# EAGLE design pi-crust15 (EAGLE 6.5.0)
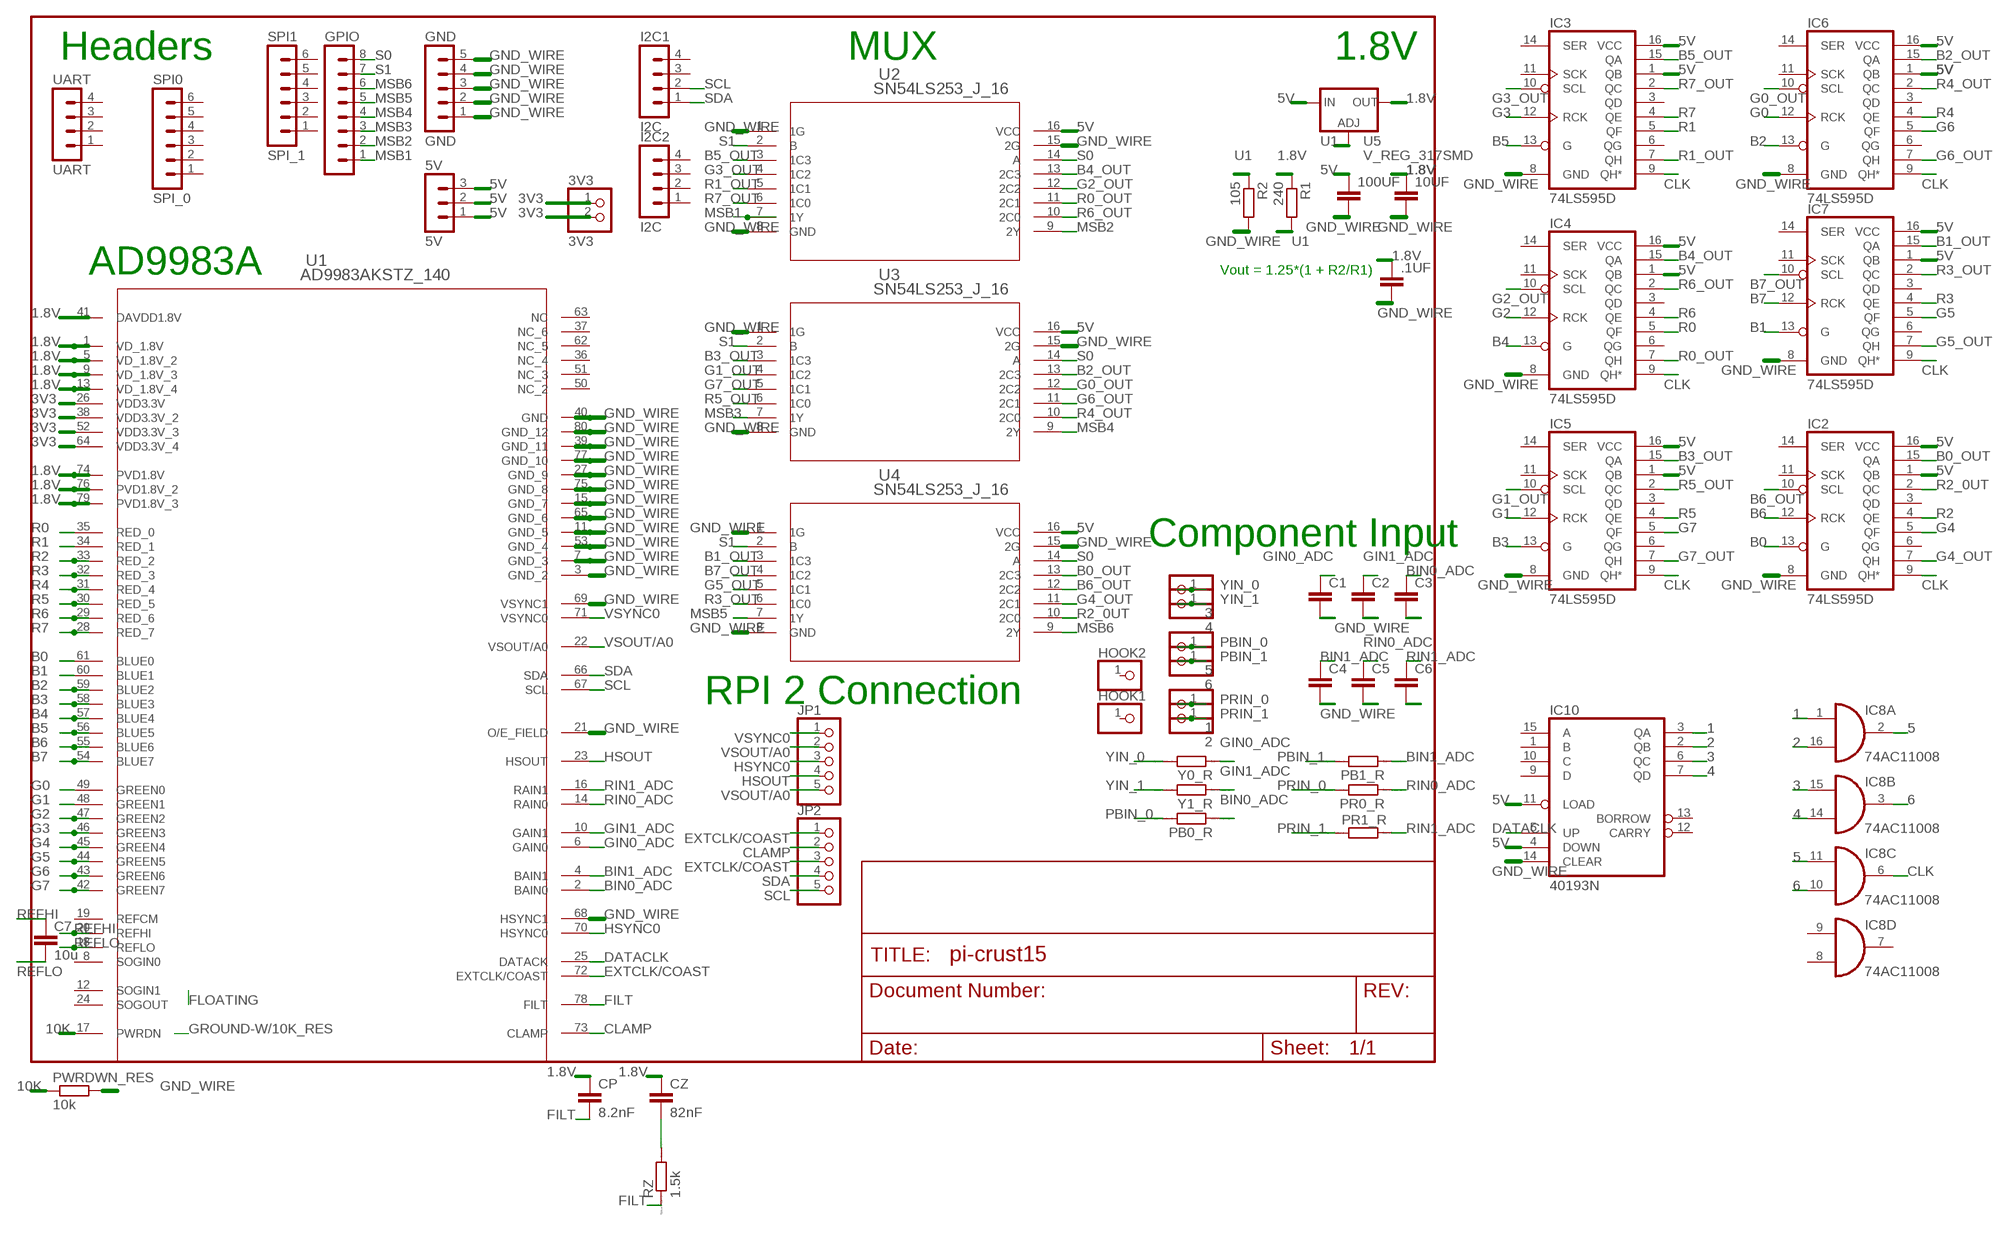
[diagram p0: schematic, sheet 1]

## Parts
1  PINHD-1X1  [1X01]
2  PINHD-1X1  [1X01]
3  PINHD-1X1  [1X01]
3V3  3V3  PINHD-1X2  [1X02]
4  PINHD-1X1  [1X01]
5  PINHD-1X1  [1X01]
5V  5V  MA03-1  [MA03-1]
6  PINHD-1X1  [1X01]
10UF  C2.5/5  [C2.5-5]
100UF  C2.5/5  [C2.5-5]
.1UF  C2.5/5  [C2.5-5]
C1  C2.5/5  [C2.5-5]
C2  C2.5/5  [C2.5-5]
C3  C2.5/5  [C2.5-5]
C4  C2.5/5  [C2.5-5]
C5  C2.5/5  [C2.5-5]
C6  C2.5/5  [C2.5-5]
C7  10u  C2.5/5  [C2.5-5]
CP  8.2nF  C2.5/5  [C2.5-5]
CZ  82nF  C2.5/5  [C2.5-5]
GND  GND  MA05-1  [MA05-1]
GPIO  MA08-1  [MA08-1]
HOOK1  PINHD-1X1  [1X01]
HOOK2  PINHD-1X1  [1X01]
I2C1  I2C  MA04-1  [MA04-1]
I2C2  I2C  MA04-1  [MA04-1]
IC2  74LS595D  [SO16]
IC3  74LS595D  [SO16]
IC4  74LS595D  [SO16]
IC5  74LS595D  [SO16]
IC6  74LS595D  [SO16]
IC7  74LS595D  [SO16]
IC8  74AC11008  [DIL16]
IC10  40193N  [DIL16]
JP1  PINHD-1X5  [1X05]
JP2  PINHD-1X5  [1X05]
PB0_R  R0204/7  [0204/7]
PB1_R  R0204/7  [0204/7]
PR0_R  R0204/7  [0204/7]
PR1_R  R0204/7  [0204/7]
PWRDWN_RES  10k  R-EU_0204/7  [0204/7]
R1  240  R-EU_0204/7  [0204/7]
R2  105  R-EU_0204/7  [0204/7]
RZ  1.5k  R0204/7  [0204/7]
SPI0  SPI_0  MA06-1  [MA06-1]
SPI1  SPI_1  MA06-1  [MA06-1]
U1  AD9983AKSTZ_140  [ST_80_2]
U2  SN54LS253_J_16  [J16]
U3  SN54LS253_J_16  [J16]
U4  SN54LS253_J_16  [J16]
U5  V_REG_317SMD  [SOT223]
UART  UART  MA04-1  [MA04-1]
Y0_R  R0204/7  [0204/7]
Y1_R  R0204/7  [0204/7]

## Nets
1: IC8.1(A:I0) IC10.3(QA)
1.8V: 10UF.1 .1UF.1 CP.1 CZ.1 R1.1 U1.1(VD_1.8V) U1.5(VD_1.8V_2) U1.9(VD_1.8V_3) U1.13(VD_1.8V_4) U1.41(DAVDD1.8V) U1.74(PVD1.8V) U1.76(PVD1.8V_2) U1.79(PVD1.8V_3) U5.2(OUT)
2: IC8.16(A:I1) IC10.2(QB)
3: IC8.15(B:I0) IC10.6(QC)
3V3: 3V3.1 3V3.2 U1.26(VDD3.3V) U1.38(VDD3.3V_2) U1.52(VDD3.3V_3) U1.64(VDD3.3V_4)
4: IC8.14(B:I1) IC10.7(QD)
5: IC8.2(A:O) IC8.11(C:I0)
5V: 5V.1 5V.2 5V.3 100UF.1 IC2.1(QB) IC2.16(VCC) IC3.1(QB) IC3.16(VCC) IC4.1(QB) IC4.16(VCC) IC5.1(QB) IC5.16(VCC) IC6.1(QB) IC6.16(VCC) IC7.1(QB) IC7.16(VCC) IC10.4(DOWN) IC10.11(LOAD) U2.16(VCC) U3.16(VCC) U4.16(VCC) U5.3(IN)
6: IC8.3(B:O) IC8.10(C:I1)
10K: PWRDWN_RES.1 U1.17(PWRDN)
B0: IC2.13(G) U1.61(BLUE0)
B0_OUT: IC2.15(QA) U4.13(2C3)
B1: IC7.13(G) U1.60(BLUE1)
B1_OUT: IC7.15(QA) U4.3(1C3)
B2: IC6.13(G) U1.59(BLUE2)
B2_OUT: IC6.15(QA) U3.13(2C3)
B3: IC5.13(G) U1.58(BLUE3)
B3_OUT: IC5.15(QA) U3.3(1C3)
B4: IC4.13(G) U1.57(BLUE4)
B4_OUT: IC4.15(QA) U2.13(2C3)
B5: IC3.13(G) U1.56(BLUE5)
B5_OUT: IC3.15(QA) U2.3(1C3)
B6: IC2.12(RCK) U1.55(BLUE6)
B6_OUT: IC2.10(SCL) U4.12(2C2)
B7: IC7.12(RCK) U1.54(BLUE7)
B7_OUT: IC7.10(SCL) U4.4(1C2)
BIN0_ADC: C3.1 PB0_R.1 U1.2(BAIN0)
BIN1_ADC: C4.1 PB1_R.1 U1.4(BAIN1)
CLAMP: JP2.2 U1.73(CLAMP)
CLK: IC2.9(QH*) IC3.9(QH*) IC4.9(QH*) IC5.9(QH*) IC6.9(QH*) IC7.9(QH*) IC8.6(C:O)
DATACLK: IC10.5(UP) U1.25(DATACK)
EXTCLK/COAST: JP2.1 JP2.3 U1.72(EXTCLK/COAST)
FILT: CP.2 RZ.1 U1.78(FILT)
G0: IC6.12(RCK) U1.49(GREEN0)
G0_OUT: IC6.10(SCL) U3.12(2C2)
G1: IC5.12(RCK) U1.48(GREEN1)
G1_OUT: IC5.10(SCL) U3.4(1C2)
G2: IC4.12(RCK) U1.47(GREEN2)
G2_OUT: IC4.10(SCL) U2.12(2C2)
G3: IC3.12(RCK) U1.46(GREEN3)
G3_OUT: IC3.10(SCL) U2.4(1C2)
G4: IC2.5(QF) U1.45(GREEN4)
G4_OUT: IC2.7(QH) U4.11(2C1)
G5: IC7.5(QF) U1.44(GREEN5)
G5_OUT: IC7.7(QH) U4.5(1C1)
G6: IC6.5(QF) U1.43(GREEN6)
G6_OUT: IC6.7(QH) U3.11(2C1)
G7: IC5.5(QF) U1.42(GREEN7)
G7_OUT: IC5.7(QH) U3.5(1C1)
GIN0_ADC: C1.1 U1.6(GAIN0) Y0_R.1
GIN1_ADC: C2.1 U1.10(GAIN1) Y1_R.1
GND_WIRE: 10UF.2 100UF.2 .1UF.2 C1.2 C2.2 C3.2 C4.2 C5.2 C6.2 GND.1 GND.2 GND.3 GND.4 GND.5 IC2.8(GND) IC3.8(GND) IC4.8(GND) IC5.8(GND) IC6.8(GND) IC7.8(GND) IC10.14(CLEAR) PWRDWN_RES.2 R2.2 U1.3(GND_2) U1.7(GND_3) U1.11(GND_5) U1.15(GND_7) U1.21(O/E_FIELD) U1.27(GND_9) U1.39(GND_11) U1.40(GND) U1.53(GND_4) U1.65(GND_6) U1.68(HSYNC1) U1.69(VSYNC1) U1.75(GND_8) U1.77(GND_10) U1.80(GND_12) U2.1(1G) U2.8(GND) U2.15(2G) U3.1(1G) U3.8(GND) U3.15(2G) U4.1(1G) U4.8(GND) U4.15(2G)
HSOUT: JP1.4 U1.23(HSOUT)
HSYNC0: JP1.3 U1.70(HSYNC0)
MSB1: GPIO.1 U2.7(1Y)
MSB2: GPIO.2 U2.9(2Y)
MSB3: GPIO.3 U3.7(1Y)
MSB4: GPIO.4 U3.9(2Y)
MSB5: GPIO.5 U4.7(1Y)
MSB6: GPIO.6 U4.9(2Y)
N$1: CZ.2 RZ.2
PBIN_0: 5.1 PB0_R.2
PBIN_1: 6.1 PB1_R.2
PRIN_0: 1.1 PR0_R.2
PRIN_1: 2.1 PR1_R.1
R0: IC4.5(QF) U1.35(RED_0)
R0_OUT: IC4.7(QH) U2.11(2C1)
R1: IC3.5(QF) U1.34(RED_1)
R1_OUT: IC3.7(QH) U2.5(1C1)
R2: IC2.4(QE) U1.33(RED_2)
R2_0UT: IC2.2(QC) U4.10(2C0)
R3: IC7.4(QE) U1.32(RED_3)
R3_OUT: IC7.2(QC) U4.6(1C0)
R4: IC6.4(QE) U1.31(RED_4)
R4_OUT: IC6.2(QC) U3.10(2C0)
R5: IC5.4(QE) U1.30(RED_5)
R5_OUT: IC5.2(QC) U3.6(1C0)
R6: IC4.4(QE) U1.29(RED_6)
R6_OUT: IC4.2(QC) U2.10(2C0)
R7: IC3.4(QE) U1.28(RED_7)
R7_OUT: IC3.2(QC) U2.6(1C0)
REFHI: C7.1 U1.20(REFHI)
REFLO: C7.2 U1.18(REFLO)
RIN0_ADC: C5.1 PR0_R.1 U1.14(RAIN0)
RIN1_ADC: C6.1 PR1_R.2 U1.16(RAIN1)
S0: GPIO.8 U2.14(A) U3.14(A) U4.14(A)
S1: GPIO.7 U2.2(B) U3.2(B) U4.2(B)
SCL: I2C1.2 JP2.5 U1.67(SCL)
SDA: I2C1.1 JP2.4 U1.66(SDA)
U1: R1.2 R2.1 U5.1(ADJ)
VSOUT/A0: JP1.2 JP1.5 U1.22(VSOUT/A0)
VSYNC0: JP1.1 U1.71(VSYNC0)
YIN_0: 3.1 Y0_R.2
YIN_1: 4.1 Y1_R.2
Unconnected: HOOK1.1 HOOK2.1 I2C1.3 I2C1.4 I2C2.1 I2C2.2 I2C2.3 I2C2.4 IC2.3(QD) IC2.6(QG) IC2.11(SCK) IC2.14(SER) IC3.3(QD) IC3.6(QG) IC3.11(SCK) IC3.14(SER) IC4.3(QD) IC4.6(QG) IC4.11(SCK) IC4.14(SER) IC5.3(QD) IC5.6(QG) IC5.11(SCK) IC5.14(SER) IC6.3(QD) IC6.6(QG) IC6.11(SCK) IC6.14(SER) IC7.3(QD) IC7.6(QG) IC7.11(SCK) IC7.14(SER) IC8.7(D:O) IC8.8(D:I1) IC8.9(D:I0) IC10.1(B) IC10.9(D) IC10.10(C) IC10.12(CARRY) IC10.13(BORROW) IC10.15(A) SPI0.1 SPI0.2 SPI0.3 SPI0.4 SPI0.5 SPI0.6 SPI1.1 SPI1.2 SPI1.3 SPI1.4 SPI1.5 SPI1.6 U1.8(SOGIN0) U1.12(SOGIN1) U1.19(REFCM) U1.24(SOGOUT) U1.36(NC_4) U1.37(NC_6) U1.50(NC_2) U1.51(NC_3) U1.62(NC_5) U1.63(NC) UART.1 UART.2 UART.3 UART.4

## Notes on the sheet
- Headers | MUX | 1.8V
- AD9983A | Vout = 1.25*(1 + R2/R1)
- Component Input
- RPI 2 Connection

## Power pins joined to a net without a drawn wire
GND: IC8.4(P:GND) IC8.5(P:GND)
VCC: IC8.12(P:VCC) IC8.13(P:VCC)
VDD: IC10.16(VDD)
VSS: IC10.8(VSS)

## Library data of the parts
1-6 HOOK1 HOOK2 = pinhead:PINHD-1X1: PIN HEADER
3V3 = pinhead:PINHD-1X2: PIN HEADER
5V = con-lstb:MA03-1: PIN HEADER; OC_FARNELL: unknown; OC_NEWARK: unknown
10UF 100UF .1UF C1-C7 CP CZ = capacitor-wima:C: CAPACITOR naming: grid - package width
GND = con-lstb:MA05-1: PIN HEADER; OC_FARNELL: unknown; OC_NEWARK: unknown
GPIO = con-lstb:MA08-1: PIN HEADER; OC_FARNELL: unknown; OC_NEWARK: unknown
I2C1 I2C2 UART = con-lstb:MA04-1: PIN HEADER; OC_FARNELL: unknown; OC_NEWARK: unknown
IC2-IC7 = SparkFun-DigitalIC:74*595: 8-bit SHIFT REGISTER, output latch; PROD_ID: IC-07875
IC8 = 74ac-logic:74AC11008: Quadruple 2-input AND
IC10 = 40xx:40193: Binary up down COUNTER
JP1 JP2 = pinhead:PINHD-1X5: PIN HEADER
PB0_R PB1_R PR0_R PR1_R RZ Y0_R Y1_R = eagle-ltspice:R: RESISTOR, European symbol; SPICEMODEL: NONE; SPICEPREFIX: R
PWRDWN_RES R1 R2 = rcl:R-EU_: RESISTOR, European symbol
SPI0 SPI1 = con-lstb:MA06-1: PIN HEADER; OC_FARNELL: unknown; OC_NEWARK: unknown
U1 = ad9983a:AD9983AKSTZ_140
U2-U4 = MUX:SN54LS253_J_16; DATASHEETURL: http://www.ti.com/lit/gpn/SN54LS253; DESCRIPTION: Dual 4-Line To 1-Line Data Selectors/Multiplexers With 3-State Outputs; FAMILY_NAME: DATA SELECTOR/MULTIPLEXER; GENERIC_PART_NUMBER: SN54LS253; INDUSTRY_STD_PKG_TYPE: CDIP; MANUFACTURER: Texas Instruments; PACKAGE_DESIGNATOR: J; PIN_COUNT: 16
U5 = SparkFun-PowerIC:V_REG_317: Voltage Regulator Standard LM317 adjustable voltage regulator. AOI (Adjust Output Input). Google 'LM317 Calculator' for easy to use app to get the two resistor values needed. 240/720 for 5V output. 240/390 for 3.3V output. Spark Fun Electronics SKU : COM-00527

## Board
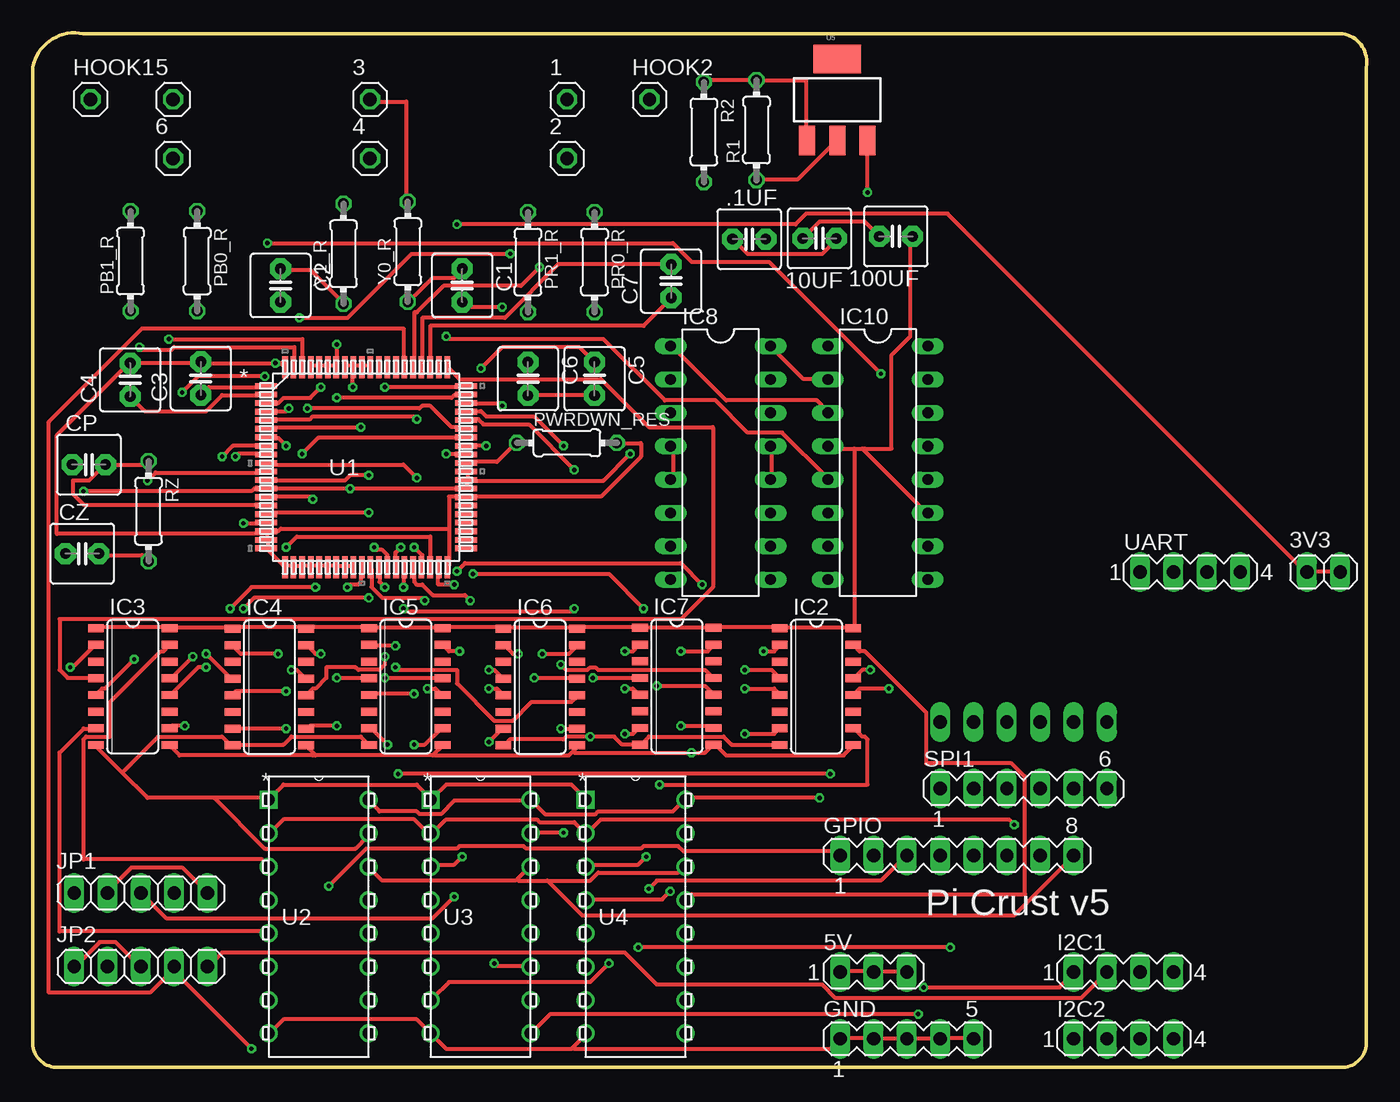
[diagram p1: board, top side]
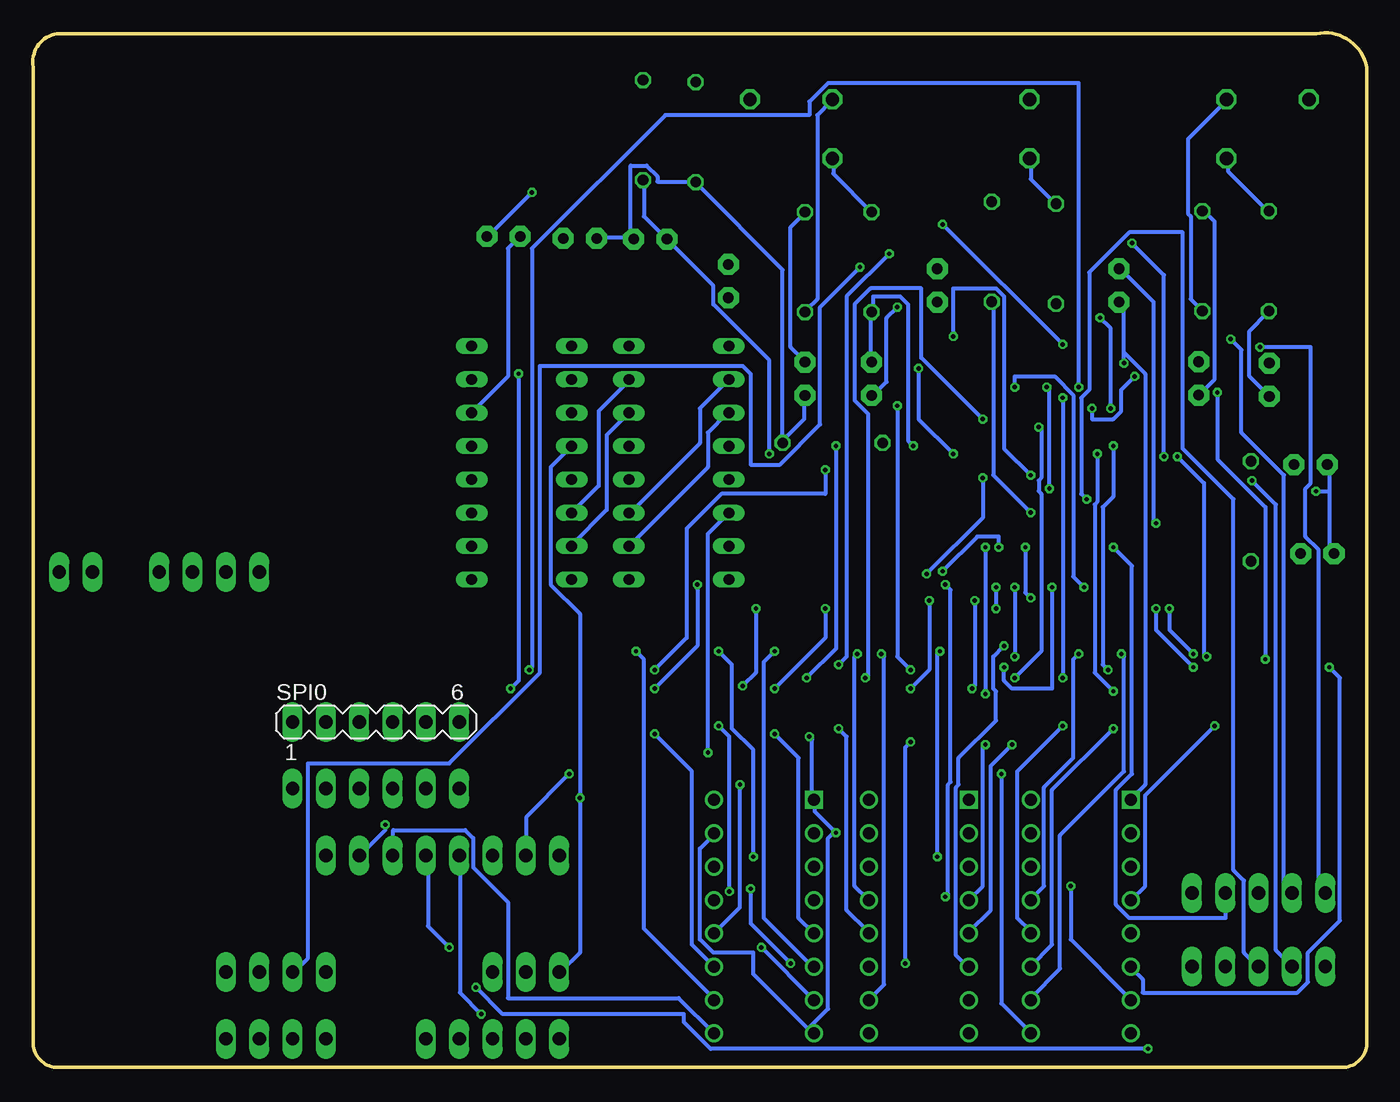
[diagram p2: board, bottom side, seen from below]

Size 101.63 x 78.79 mm. Coordinates in mm from the lower left corner, seen from the top.
Outline: 101.6,76.19 101.6,1.79 arc-90 99.69,0 1.91,0 arc-90 0,1.79 0,76.19 arc-90 3.82,78.73 99.82,78.73 arc-90 101.6,76.19
Copper layers (1*16): Top 0.0356mm / dielectric 1.5011mm / Bottom 0.0356mm
Design rules "default *": minimum track width 12mil, minimum drill 13mil, track to track 6mil, track to pad 6mil, pad to pad 6mil, via to via 6mil, smd to smd 6mil, copper to edge 15mil, drill to drill 6mil, minimum pad ring 7mil, minimum via ring 7mil, stop-mask expansion 4mil, vias tented up to drill 20mil, thermal gap 10mil

### Footprints (pad centres in the part's own frame; a part is rotated, then mirrored left to right if it is on the bottom)
1X01 = drill 1.016 octagon: 1 0,0
1X02 = drill 1.016 long: 1 -1.27,0; 2 1.27,0
MA03-1 = drill 1.016 long: 1 -2.54,0; 2 0,0; 3 2.54,0
C2.5-5 = drill 0.813 pad 1.6 octagon: 1 -1.27,0; 2 1.27,0
MA05-1 = drill 1.016 long: 1 -5.08,0; 2 -2.54,0; 3 0,0; 4 2.54,0; 5 5.08,0
MA08-1 = drill 1.016 long: 1 -8.89,0; 2 -6.35,0; 3 -3.81,0; 4 -1.27,0; 5 1.27,0; 6 3.81,0; 7 6.35,0; 8 8.89,0
MA04-1 = drill 1.016 long: 1 -3.81,0; 2 -1.27,0; 3 1.27,0; 4 3.81,0
SO16 = smd 0.6 x 1.2: 1 -4.445,-2.8; 2 -3.175,-2.8; 3 -1.905,-2.8; 4 -0.635,-2.8; 5 0.635,-2.8; 6 1.905,-2.8; 7 3.175,-2.8; 8 4.445,-2.8; 9 4.445,2.8; 10 3.175,2.8; 11 1.905,2.8; 12 0.635,2.8; 13 -0.635,2.8; 14 -1.905,2.8; 15 -3.175,2.8; 16 -4.445,2.8
DIL16 = drill 0.813 long: 1 -8.89,-3.81; 2 -6.35,-3.81; 3 -3.81,-3.81; 4 -1.27,-3.81; 5 1.27,-3.81; 6 3.81,-3.81; 7 6.35,-3.81; 8 8.89,-3.81; 9 8.89,3.81; 10 6.35,3.81; 11 3.81,3.81; 12 1.27,3.81; 13 -1.27,3.81; 14 -3.81,3.81; 15 -6.35,3.81; 16 -8.89,3.81
1X05 = drill 1.016 long: 1 -5.08,0; 2 -2.54,0; 3 0,0; 4 2.54,0; 5 5.08,0
0204/7 = drill 0.813 octagon: 1 -3.81,0; 2 3.81,0
MA06-1 = drill 1.016 long: 1 -6.35,0; 2 -3.81,0; 3 -1.27,0; 4 1.27,0; 5 3.81,0; 6 6.35,0
ST_80_2 = smd 0.432 x 1.676: 1 0.33,7.62; 5 -0.33,7.62; 8 2.286,7.62; 9 -0.965,7.62; 12 1.626,7.62; 13 -1.626,7.62; 15 -6.172,-7.62; 18 4.216,7.62; 19 5.537,7.62; 20 4.877,7.62; 22 -4.877,7.62; 23 4.877,-7.62; 24 0.965,7.62; 26 -2.286,7.62; 27 -5.537,-7.62; 28 6.172,7.62; 38 -2.921,7.62; 39 -4.877,-7.62; 40 -4.216,-7.62; 42 4.216,-7.62; 43 3.581,-7.62; 44 2.921,-7.62; 45 2.286,-7.62; 46 1.626,-7.62; 47 0.965,-7.62; 48 0.33,-7.62; 49 -0.33,-7.62; 52 -3.581,7.62; 53 -3.581,-7.62; 64 -4.216,7.62; 65 -2.921,-7.62; 66 2.921,7.62; 67 3.581,7.62; 68 6.172,-7.62; 69 -6.172,7.62; 70 5.537,-7.62; 71 -5.537,7.62; 75 -2.286,-7.62; 77 -1.626,-7.62; 80 -0.965,-7.62 | smd 1.676 x 0.432: 2 -7.62,6.172; 3 -7.62,-4.877; 4 -7.62,5.537; 6 -7.62,-3.581; 7 -7.62,-5.537; 10 -7.62,-4.216; 11 -7.62,-6.172; 14 7.62,0.965; 16 7.62,1.626; 17 7.62,0.33; 21 7.62,-2.286; 25 -7.62,-0.965; 29 7.62,6.172; 30 7.62,5.537; 31 7.62,4.877; 32 7.62,4.216; 33 7.62,3.581; 34 7.62,2.921; 35 7.62,2.286; 36 7.62,-6.172; 37 7.62,-5.537; 41 -7.62,-1.626; 50 7.62,-4.877; 51 7.62,-4.216; 54 -7.62,0.33; 55 -7.62,0.965; 56 -7.62,1.626; 57 -7.62,2.286; 58 -7.62,2.921; 59 -7.62,3.581; 60 -7.62,4.216; 61 -7.62,4.877; 62 7.62,-3.581; 63 7.62,-2.921; 72 -7.62,-2.286; 73 -7.62,-0.33; 74 7.62,-1.626; 76 7.62,-0.965; 78 -7.62,-2.921; 79 7.62,-0.33
J16 = drill 0.914 square: 1 -7.62,17.78 | drill 0.914: 2 -7.62,15.24; 3 -7.62,12.7; 4 -7.62,10.16; 5 -7.62,7.62; 6 -7.62,5.08; 7 -7.62,2.54; 8 -7.62,0; 9 0,0; 10 0,2.54; 11 0,5.08; 12 0,7.62; 13 0,10.16; 14 0,12.7; 15 0,15.24; 16 0,17.78
SOT223 = smd 1.219 x 2.235: 1 -2.311,-3.099; 2 0,-3.099; 3 2.311,-3.099 | smd 3.6 x 2.2: 4 0,3.099

### Placement (x,y rotation side)
1  40.7,73.73 0 top
2  40.7,69.23 0 top
3  25.69,73.73 0 top
3V3  98.35,37.73 0 top
4  25.69,69.23 0 top
5  10.68,73.73 0 top
5V  64.06,7.25 0 top
6  10.68,69.23 0 top
10UF  59.94,63.13 180 top
100UF  65.76,63.29 180 top
.1UF  54.58,63.08 0 top
C1  32.72,59.55 270 top
C2  18.87,59.55 270 top
C3  12.8,52.47 90 top
C4  7.42,52.36 90 top
C5  42.8,52.44 270 top
C6  37.72,52.44 270 top
C7  48.64,59.88 90 top
CP  4.27,45.91 0 top
CZ  3.76,39.13 0 top
GND  66.6,2.17 0 top
GPIO  70.41,16.14 0 top
HOOK1  4.39,73.73 0 top
HOOK2  46.99,73.73 0 top
I2C1  83.11,7.25 0 top
I2C2  83.11,2.17 0 top
IC2  59.72,29 270 top
IC3  7.62,29 270 top
IC4  18.03,28.97 270 top
IC5  28.42,29 270 top
IC6  38.66,28.97 270 top
IC7  49.07,29.02 270 top
IC8  52.4,46.04 270 top
IC10  64.39,46.04 270 top
JP1  8.23,13.27 0 top
JP2  8.23,7.69 0 top
PB0_R  12.52,61.41 270 top
PB1_R  7.44,61.41 90 top
PR0_R  42.8,61.33 270 top
PR1_R  37.72,61.33 270 top
PWRDWN_RES  40.69,47.56 0 top
R1  55.14,71.39 90 top
R2  51.13,71.24 270 top
RZ  8.81,42.36 270 top
SPI0  75.49,26.3 0 bottom
SPI1  75.49,21.22 0 top
U1  25.4,45.71 0 top
U2  25.6,2.58 0 top
U3  37.92,2.58 0 top
U4  49.73,2.58 0 top
U5  61.29,73.7 0 top
UART  88.19,37.73 0 top
Y0_R  28.57,62.12 90 top
Y1_R  23.67,61.97 90 top

### Tracks (layer width: path | path; a pad name or v marks a point on that pad's centre or on a via)
1
  Top 0.305: IC8.1 48.77,54.85 52.83,50.79 59.74,50.79 60.55,49.98 IC10.3
1.8V  (via drill 0.33)
  Top 0.305: U5.2 61.16,70.5 58.32,67.66 55.27,67.66 R1.1 | 10UF.1 61.16,62.98 60.15,61.97 54.46,61.97 53.44,62.98 .1UF.1 | U1.13 23.77,53.43 24.38,53.43 U1.9 | U1.1 25.6,53.43 25.2,53.43 U1.5 24.99,53.43 24.59,53.43 U1.9 | U1.79 33.12,45.3 33.12,44.9 U1.76 33.12,44.69 | 33.12,44.69 33.12,44.08 U1.74 v24.18,44.08 U1.41 16.87,44.08 16.66,43.88 v3.86,43.88 | v24.38,51.81 24.38,53.23 U1.9 | v45.52,46.73 43.48,44.69 33.12,44.69
  Bottom 0.305: R1.1 55.07,67.45 55.07,64.81 53.44,63.19 .1UF.1 53.24,62.98 49.78,59.53 49.78,58.11 45.52,53.84 v45.52,46.73 | 2.85,43.88 2.85,45.91 CP.1 | 2.85,43.88 2.85,39.41 2.64,39.21 CZ.1 | v24.38,51.81 24.18,51.6 v24.18,44.08 | v3.86,43.88 2.85,43.88
2
  Top 0.305: IC8.16 58.73,52.42 60.55,52.42 IC10.2
3
  Bottom 0.305: IC10.6 58.52,44.29 58.52,49.98 56.29,52.21 IC8.15
3V3  (via drill 0.33)
  Top 0.305: U1.64 21.34,53.43 21.74,53.43 U1.52 21.95,53.43 22.35,53.43 U1.38 22.55,53.43 22.96,53.43 U1.26 23.16,53.43 v23.16,55.06 | v32.31,64.2 58.12,64.2 58.93,65.01 69.7,65.01 96.93,37.79 3V3.1 97.13,37.79 99.57,37.79 3V3.2
  Bottom 0.305: v32.31,64.2 v23.16,55.06
4
  Bottom 0.305: IC8.14 57.91,48.15 57.91,42.46 60.55,39.82 IC10.7
5
  Bottom 0.305: IC8.2 50.8,50.18 50.8,47.54 56.08,42.26 IC8.11
5V  (via drill 0.33)
  Top 0.305: IC3.1 4.88,33.52 10.36,33.52 IC3.16 10.57,33.52 15.04,33.52 IC4.1 15.24,33.52 20.73,33.52 IC4.16 20.93,33.52 25.6,33.52 IC5.1 25.81,33.52 31.09,33.52 IC5.16 31.29,33.52 35.76,33.52 IC6.1 35.97,33.52 41.45,33.52 IC6.16 41.66,33.52 46.13,33.52 IC7.1 46.33,33.52 51.82,33.52 IC7.16 52.02,33.52 56.9,33.52 IC2.1 57.1,33.52 62.38,33.52 IC2.16 62.59,33.52 62.59,47.13 | U2.16 25.6,20.31 26.42,19.5 29.26,19.5 29.46,19.29 31.09,19.29 32.11,20.31 37.8,20.31 U3.16 38,20.31 39.01,19.29 42.88,19.29 43.08,19.5 48.77,19.5 49.58,20.31 U4.16 49.78,20.51 v59.94,20.51 | v63.6,66.64 U5.3 | 5V.1 61.57,7.31 64.01,7.31 5V.2 64.21,7.31 66.45,7.31 5V.3 | 63.3,47.03 63.2,47.13 62.59,47.13 | 63.3,47.03 68.07,42.26 IC10.11 | 62.59,47.13 60.76,47.13 IC10.4 | 100UF.1 66.85,63.19 66.85,55.67 65.43,54.24 65.43,47.13 63.4,47.13 63.3,47.03
  Bottom 0.305: v63.6,66.64 66.85,63.39 100UF.1 | IC10.4 62.18,45.71 62.18,36.77 59.94,34.53 v59.94,20.51 59.94,8.73 61.37,7.31 5V.1
6
  Bottom 0.305: IC8.10 50.19,45.71 50.19,48.35 48.77,49.77 IC8.3
10K
  Top 0.305: U1.17 33.12,46.12 35.36,46.12 36.78,47.54 PWRDWN_RES.1
B0  (via drill 0.33)
  Top 0.305: v63.8,30.27 63.2,30.27 62.59,29.66 IC2.13 | v21.95,51.81 21.13,50.99 19.1,50.99 18.69,50.59 U1.61
  Bottom 0.305: v63.8,30.27 63.6,30.47 63.6,62.37 53.44,72.53 42.47,72.53 42.47,73.55 41.05,74.97 21.95,74.97 v21.95,51.81
B0_OUT
  Top 0.305: U4.13 50.19,13.2 75.59,13.2 75.59,22.14 74.57,23.15 68.07,23.15 68.07,27.02 63.4,31.69 62.99,31.69 62.59,32.1 IC2.15
B1  (via drill 0.33)
  Top 0.305: v40.23,30.67 40.64,30.27 42.27,30.27 42.47,30.47 42.88,30.47 43.08,30.27 51.21,30.27 51.82,29.66 IC7.13 | v36.37,61.97 28.85,61.97 23.98,57.09 v20.32,57.09 | v19.51,50.18 19.3,49.98 17.88,49.98 U1.60
  Bottom 0.305: v40.23,30.67 39.62,31.28 39.62,58.72 v36.37,61.97 | v20.32,57.09 19.51,56.28 v19.51,50.18
B1_OUT  (via drill 0.33)
  Top 0.305: v49.38,31.69 51.41,31.69 51.82,32.1 IC7.15 | v46.74,16.04 46.13,15.43 42.27,15.43 U4.3
  Bottom 0.305: v49.38,31.69 48.36,30.67 48.36,25.8 46.74,24.17 v46.74,16.04
B2  (via drill 0.33)
  Top 0.305: v38.2,29.66 41.45,29.66 IC6.13 | v29.26,49.37 29.06,49.57 21.34,49.57 21.13,49.37 17.88,49.37 U1.59
  Bottom 0.305: v38.2,29.66 38,29.86 38,49.77 39.01,50.79 39.01,58.11 37.8,59.32 33.93,59.32 33.93,54.04 v29.26,49.37
B2_OUT  (via drill 0.33)
  Top 0.305: v38.81,31.49 40.84,31.49 41.45,32.1 IC6.15
  Bottom 0.305: v38.81,31.49 39.01,31.28 39.01,13.81 38,12.79 U3.13
B3  (via drill 0.33)
  Top 0.305: v26.82,29.66 31.09,29.66 IC5.13 | v24.99,48.76 17.88,48.76 U1.58
  Bottom 0.305: v26.82,29.66 24.79,31.69 24.79,43.68 24.99,43.88 24.99,44.69 24.79,44.9 24.79,48.55 v24.99,48.76
B3_OUT  (via drill 0.33)
  Top 0.305: v32.51,31.69 31.7,31.69 31.29,32.1 IC5.15 | v32.72,16.04 32.11,15.43 30.48,15.43 U3.3
  Bottom 0.305: v32.51,31.69 32.72,31.49 v32.72,16.04
B4  (via drill 0.33)
  Top 0.305: v19.71,30.27 20.12,30.27 20.73,29.66 IC4.13 | v19.3,47.34 18.69,47.95 17.88,47.95 U1.57
  Bottom 0.305: v19.71,30.27 20.12,30.67 20.12,42.66 19.3,43.48 v19.3,47.34
B4_OUT  (via drill 0.33)
  Top 0.305: v21.95,31.49 21.54,31.49 20.93,32.1 IC4.15
  Bottom 0.305: v21.95,31.49 22.35,31.08 22.35,23.56 24.59,21.33 24.59,13.81 25.6,12.79 U2.13
B5  (via drill 0.33)
  Top 0.305: v12.19,31.28 10.57,29.66 IC3.13 | v14.43,46.52 15.24,47.34 U1.56
  Bottom 0.305: v12.19,31.28 12.39,31.49 12.39,44.49 v14.43,46.52
B5_OUT
  Top 0.305: IC3.15 10.36,32.1 9.96,31.69 9.75,31.69 5.89,27.83 5.89,25.19 4.06,25.19 3.86,24.98 3.86,15.84 17.48,15.84 17.88,15.43 U2.3
B6  (via drill 0.33)
  Top 0.305: v65.23,28.84 62.99,28.84 62.59,28.44 IC2.12 | v64.62,52.82 56.08,61.36 50.19,61.36 48.77,62.78 v17.88,62.78 | v15.44,46.52 15.65,46.73 17.68,46.73 U1.55
  Bottom 0.305: v65.23,28.84 64.62,29.45 v64.62,52.82 | v17.88,62.78 15.44,60.34 v15.44,46.52
B6_OUT  (via drill 0.33)
  Top 0.305: v47.75,21.53 63.6,21.53 63.6,24.98 63.4,25.19 63.2,25.19 62.59,25.8 IC2.10
  Bottom 0.305: v47.75,21.53 47.75,12.18 U4.12
B7  (via drill 0.33)
  Top 0.305: v47.55,29.05 51.21,29.05 51.82,28.44 IC7.12 | v46.53,34.94 43.89,37.58 v33.53,37.58 | v29.26,44.9 28.25,45.91 17.88,45.91 U1.54
  Bottom 0.305: v47.55,29.05 46.53,30.06 v46.53,34.94 | v33.53,37.58 29.26,41.85 v29.26,44.9
B7_OUT  (via drill 0.33)
  Top 0.305: v49.38,26 51.82,26 IC7.10 | v48.56,13.4 47.95,12.79 42.27,12.79 U4.4
  Bottom 0.305: v49.38,26 48.56,25.19 v48.56,13.4
BIN0_ADC
  Top 0.305: C3.1 13.41,51.81 17.68,51.81 U1.2
  Bottom 0.305: C3.1 11.58,52.42 11.58,64.4 12.39,65.22 PB0_R.1
BIN1_ADC
  Top 0.305: C4.1 8.53,49.98 13.21,49.98 14.43,51.2 17.68,51.2 U1.4
  Bottom 0.305: C4.1 8.94,52.62 8.94,56.07 7.52,57.5 PB1_R.1
CLAMP  (via drill 0.33)
  Top 0.305: v8.74,44.69 9.35,45.3 17.68,45.3 U1.73
  Bottom 0.305: v8.74,44.69 6.91,42.87 6.91,8.93 5.69,7.71 JP2.2
CLK  (via drill 0.33)
  Top 0.305: 21.44,23.87 21.54,23.76 30.48,23.76 30.58,23.87 | 21.44,23.87 20.93,24.37 IC4.9 | 30.58,23.87 31.09,24.37 IC5.9 | 41.15,24.07 40.84,23.76 30.68,23.76 30.58,23.87 | 41.15,24.07 41.45,24.37 IC6.9 | IC3.9 10.57,24.37 11.18,23.76 21.34,23.76 21.44,23.87 | 41.15,24.07 41.25,23.97 v50.19,23.97 51.21,23.97 51.82,24.58 IC7.9 52.02,24.58 52.83,23.76 61.77,23.76 62.38,24.37 IC2.9
  Bottom 0.305: IC8.6 50.19,40.63 v50.19,23.97
DATACLK  (via drill 0.33)
  Top 0.305: v25.6,45.1 24.18,45.1 23.77,44.69 17.88,44.69 U1.25 | v31.5,55.67 31.7,55.46 43.48,55.46 48.16,50.79 52.02,50.79 54.46,48.35 57.1,48.35 60.55,44.9 IC10.5
  Bottom 0.305: v25.6,45.1 27.64,47.13 27.64,58.72 28.25,59.32 31.5,59.32 v31.5,55.67
EXTCLK/COAST  (via drill 0.33)
  Top 0.305: v21.34,43.27 21.13,43.48 17.88,43.48 U1.72 | JP2.1 3.25,7.71 5.08,9.54 6.3,9.54 8.13,7.71 JP2.3
  Bottom 0.305: v21.34,43.27 21.74,43.68 21.74,50.99 21.13,51.6 21.13,60.54 18.09,63.59 14.02,63.59 14.02,47.13 10.16,43.27 10.16,15.03 9.35,14.21 9.35,8.73 8.33,7.71 JP2.3
FILT
  Top 0.305: U1.78 17.68,42.87 3.86,42.87 3.05,43.68 3.05,44.69 4.27,44.69 5.49,45.91 CP.2 8.53,45.91 8.74,46.12 RZ.1
G0  (via drill 0.33)
  Top 0.305: v27.64,30.47 27.84,30.27 32.31,30.27 32.31,29.25 35.15,26.41 36.58,26.41 38,27.83 41.05,27.83 41.45,28.23 IC6.12 | v23.98,36.57 24.18,36.77 24.79,36.77 24.99,36.97 24.99,37.99 U1.49
  Bottom 0.305: v27.64,30.47 27.64,29.45 27.03,28.84 23.98,28.84 v23.98,36.57
G0_OUT  (via drill 0.33)
  Top 0.305: v40.23,25.8 IC6.10
  Bottom 0.305: v40.23,25.8 39.62,25.19 39.62,11.98 38,10.35 U3.12
G1  (via drill 0.33)
  Top 0.305: v30.07,28.84 30.68,28.84 31.09,28.44 IC5.12 | v29.87,35.55 29.67,35.75 26.62,35.75 25.81,36.57 25.81,37.99 U1.48
  Bottom 0.305: v30.07,28.84 29.87,29.05 v29.87,35.55
G1_OUT  (via drill 0.33)
  Top 0.305: v29.06,24.58 29.87,24.58 31.09,25.8 IC5.10
  Bottom 0.305: v29.06,24.58 29.26,24.37 29.26,13.81 30.28,12.79 U3.4
G2  (via drill 0.33)
  Top 0.305: v26.82,31.28 26.82,30.67 26.42,30.27 24.79,30.27 24.59,30.47 22.35,30.47 22.35,29.66 21.54,28.84 21.34,28.84 20.93,28.44 IC4.12 | v26.82,36.57 26.42,36.97 26.42,37.99 U1.47
  Bottom 0.305: v26.82,36.57 v26.82,31.28
G2_OUT  (via drill 0.33)
  Top 0.305: v23.16,26 21.13,26 20.93,25.8 IC4.10
  Bottom 0.305: v23.16,26 26.62,22.54 26.62,11.37 25.6,10.35 U2.12
G3  (via drill 0.33)
  Top 0.305: v13.21,30.47 12.6,30.47 10.57,28.44 IC3.12 | v16.05,34.94 16.87,35.75 v25.6,35.75 | v26.01,39.61 26.21,39.41 26.62,39.41 27.03,39 U1.46
  Bottom 0.305: v13.21,30.47 16.05,33.32 v16.05,34.94 | v25.6,35.75 26.01,36.16 v26.01,39.61
G3_OUT  (via drill 0.33)
  Top 0.305: v11.58,26 10.57,26 IC3.10
  Bottom 0.305: v11.58,26 16.87,20.72 16.87,13.81 17.88,12.79 U2.4
G4  (via drill 0.33)
  Top 0.305: v54.25,28.84 56.49,28.84 56.9,28.44 IC2.5 | v51,36.77 49.38,38.4 32.92,38.4 v32.31,37.79 | v28.04,39.61 27.64,39.21 27.64,38.19 U1.45
  Bottom 0.305: v54.25,28.84 51,32.1 v51,36.77 | v32.31,37.79 29.67,40.43 28.04,40.43 v28.04,39.61
G4_OUT  (via drill 0.33)
  Top 0.305: v54.25,25.39 56.49,25.39 56.9,25.8 IC2.7
  Bottom 0.305: v54.25,25.39 51.41,22.54 51.41,9.34 U4.11
G5  (via drill 0.33)
  Top 0.305: v45.11,28.84 45.72,28.84 46.13,28.44 IC7.5 | v41.25,34.94 41.05,34.74 28.45,34.74 v28.25,34.94 | v28.25,36.57 28.25,37.99 U1.44
  Bottom 0.305: v45.11,28.84 41.25,32.71 v41.25,34.94 | v28.25,36.57 v28.25,34.94
G5_OUT  (via drill 0.33)
  Top 0.305: v45.11,25.39 45.72,25.39 46.13,25.8 IC7.7
  Bottom 0.305: v45.11,25.39 43.28,23.56 43.28,11.37 U4.5
G6  (via drill 0.33)
  Top 0.305: v34.75,28.84 35.36,28.84 35.76,28.44 IC6.5 | v33.33,35.55 32.92,35.96 30.48,35.96 29.67,36.77 29.26,36.77 29.06,36.97 29.06,37.99 U1.43
  Bottom 0.305: v34.75,28.84 33.33,30.27 v33.33,35.55
G6_OUT  (via drill 0.33)
  Top 0.305: v34.75,24.78 35.76,25.8 IC6.7 | v35.15,7.92 35.36,7.71 37.8,7.71 U3.11
  Bottom 0.305: v34.75,24.78 35.15,24.37 v35.15,7.92
G7  (via drill 0.33)
  Top 0.305: v29.06,28.44 25.81,28.44 IC5.5 | v29.06,39.61 29.67,39 29.67,38.19 U1.42
  Bottom 0.305: v29.06,39.61 v29.06,28.44
G7_OUT  (via drill 0.33)
  Top 0.305: v27.03,24.58 25.81,25.8 IC5.7
  Bottom 0.305: v27.03,24.58 28.65,22.95 28.65,11.98 30.28,10.35 U3.5
GIN0_ADC  (via drill 0.33)
  Top 0.305: v25.6,42.26 17.88,42.26 U1.6 | C1.1 32.72,60.75 32.11,60.14 30.48,60.14 28.65,58.31 Y0_R.1
  Bottom 0.305: v25.6,42.26 28.45,45.1 28.45,58.31 Y0_R.1
GIN1_ADC  (via drill 0.33)
  Top 0.305: v16.05,41.44 17.68,41.44 U1.10 | Y1_R.1 23.57,58.31 21.13,60.75 18.9,60.75 C2.1
  Bottom 0.305: v16.05,41.44 16.26,41.65 16.26,58.31 18.69,60.75 C2.1
GND
  Top 0.305: IC8.5 48.77,44.9 48.77,47.13 IC8.4
GND_WIRE  (via drill 0.33)
  Top 0.305: IC6.8 35.97,24.58 36.37,24.98 40.44,24.98 40.64,25.19 v42.47,25.19 44.3,25.19 44.91,24.58 IC7.8 46.33,24.58 46.94,25.19 52.63,25.19 53.24,24.58 56.9,24.58 IC2.8 | v40.44,17.87 38,17.87 U3.15 | U4.1 42.06,20.51 41.05,21.53 31.5,21.53 30.48,20.51 U3.1 30.28,20.51 29.26,21.53 19.1,21.53 18.09,20.51 U2.1 17.88,20.51 13.82,20.51 | 6.81,22.44 8.74,20.51 13.82,20.51 | 6.81,22.44 4.88,24.37 IC3.8 | 6.81,22.44 9.55,25.19 14.43,25.19 15.04,24.58 IC4.8 15.24,24.58 19.1,24.58 19.71,25.19 24.99,25.19 25.6,24.58 IC5.8 | 13.82,20.51 17.68,16.65 24.59,16.65 25.6,17.67 U2.15 | GND.5 71.53,2.23 69.29,2.23 GND.4 69.09,2.23 66.65,2.23 GND.3 66.45,2.23 64.21,2.23 GND.2 64.01,2.23 61.57,2.23 GND.1 60.76,1.41 41.25,1.41 41.15,1.51 | U2.8 18.09,2.63 19.1,3.65 29.26,3.65 30.28,2.63 U3.8 30.48,2.43 31.5,1.41 41.05,1.41 41.15,1.51 | 41.15,1.51 42.06,2.43 U4.8 | 10UF.2 59.94,64.4 63.4,64.4 64.41,63.39 100UF.2 | 12.8,53.64 v18.49,53.64 18.9,53.64 19.1,53.43 U1.69 | 12.8,53.64 C4.2 7.32,53.64 1.83,48.15 1.83,40.63 17.88,40.63 | 12.8,53.64 C3.2 | 31.7,41.04 31.7,43.48 32.92,43.48 U1.21 33.12,43.48 43.28,43.48 46.33,46.52 46.33,47.54 44.5,47.54 PWRDWN_RES.2 | 31.7,41.04 31.7,38.19 U1.68 | 17.88,40.63 17.88,40.22 U1.7 17.88,40.02 17.88,39.61 U1.11 17.88,39.41 19.1,38.19 U1.15 19.3,38.19 19.71,38.19 U1.27 19.91,38.19 20.52,38.19 | 17.88,40.63 17.88,40.83 | 23.77,38.19 23.16,38.19 U1.75 22.96,38.19 22.55,38.19 U1.65 22.35,38.19 21.95,38.19 U1.53 21.74,38.19 21.34,38.19 U1.40 21.13,38.19 20.52,38.19 | 23.77,38.19 24.38,38.19 U1.80 | 23.77,38.19 U1.77 | 20.52,38.19 U1.39 | 31.7,41.04 18.9,41.04 18.69,40.83 17.88,40.83
  Top 0.305: 17.88,40.83 U1.3 17.88,40.63 | C6.2 37.8,51.2 42.67,51.2 C5.2 | v35.76,57.9 32.92,57.9 32.72,58.11 C1.2
  Bottom 0.305: v42.47,25.19 42.27,24.98 42.27,20.51 U4.1 42.06,20.31 42.06,19.5 v40.44,17.87 40.64,17.87 41.05,17.46 41.05,4.46 42.47,3.04 U4.8 42.27,2.63 46.74,7.1 46.74,8.73 49.78,8.73 50.8,9.74 50.8,16.65 49.78,17.67 U4.15 | 10UF.2 58.52,63.19 56.08,63.19 .1UF.2 55.88,63.19 56.08,63.39 56.08,68.67 54.86,68.67 54.05,67.86 54.05,67.45 51.21,67.45 R2.2 51,67.25 44.5,60.75 PWRDWN_RES.2 44.5,47.74 42.88,49.37 42.88,50.99 C5.2 | IC10.14 65.43,52.62 65.43,62.37 64.62,63.19 100UF.2 | C2.2 18.49,57.9 18.49,54.45 | v18.49,53.64 18.49,54.45 | v35.76,57.9 36.58,57.09 36.58,52.21 37.59,51.2 C6.2 | 18.49,54.45 16.87,52.82 16.87,21.53 17.88,20.51 U2.1
HSOUT  (via drill 0.33)
  Top 0.305: U1.23 30.28,40.43 20.12,40.43 v19.3,39.61
  Bottom 0.305: v19.3,39.61 17.88,38.19 17.88,22.34 19.1,21.12 19.1,12.38 18.09,11.37 10.77,11.37 JP1.4
HSYNC0  (via drill 0.33)
  Top 0.305: v32.11,36.77 30.89,36.77 30.89,37.99 U1.70 | v32.11,13 30.48,11.37 10.16,11.37 8.33,13.2 JP1.3
  Bottom 0.305: v32.11,36.77 31.7,36.36 31.7,21.73 31.9,21.53 31.9,13.2 v32.11,13
MSB1  (via drill 0.33)
  Top 0.305: v22.55,13.81 25.4,16.65 32.31,16.65 32.51,16.86 37.39,16.86 37.59,16.65 46.33,16.65 46.53,16.86 49.17,16.86 49.58,16.45 61.16,16.45 61.37,16.25 GPIO.1
  Bottom 0.305: v22.55,13.81 22.55,9.74 18.09,5.27 U2.7
MSB2  (via drill 0.33)
  Top 0.305: v60.76,22.34 v27.84,22.34
  Bottom 0.305: v27.84,22.34 27.84,4.87 25.6,2.63 U2.9 | v60.76,22.34 64.01,19.09 64.01,16.25 GPIO.2
MSB3  (via drill 0.33)
  Top 0.305: v43.89,7.92 42.47,6.49 31.7,6.49 30.48,5.27 U3.7 | v46.94,13.6 47.55,14.21 64.62,14.21 66.45,16.04 GPIO.3
  Bottom 0.305: v43.89,7.92 46.94,10.96 v46.94,13.6
MSB4  (via drill 0.33)
  Top 0.305: v67.46,4.05 39.42,4.05 38,2.63 U3.9
  Bottom 0.305: v67.46,4.05 69.09,5.68 69.09,16.04 GPIO.4
MSB5  (via drill 0.33)
  Top 0.305: v69.9,9.13 v46.13,9.13
  Bottom 0.305: v46.13,9.13 U4.7 | v69.9,9.13 71.53,10.76 71.53,16.04 GPIO.5
MSB6
  Bottom 0.305: U4.9 52.43,5.27 65.43,5.27 65.43,12.59 68.07,15.23 68.07,17.46 68.68,18.07 74.17,18.07 74.17,16.25 GPIO.6
N$1
  Top 0.305: RZ.2 8.74,38.6 8.33,39 5.08,39 CZ.2
PBIN_0
  Bottom 0.305: PB0_R.2 12.6,57.7 13.41,58.51 13.41,64.81 13.61,65.01 13.61,70.7 10.77,73.55 5.1
PBIN_1
  Bottom 0.305: PB1_R.2 7.52,65.22 10.57,68.27 10.57,69.08 6.1
PRIN_0
  Bottom 0.305: PR0_R.2 42.67,57.7 41.86,58.51 41.86,72.53 40.84,73.55 1.1
PRIN_1
  Bottom 0.305: PR1_R.1 40.64,68.06 40.64,69.08 2.1
R0  (via drill 0.33)
  Top 0.305: v19.3,28.64 15.44,28.64 15.24,28.44 IC4.5 | v20.52,46.73 21.74,47.95 32.92,47.95 U1.35
  Bottom 0.305: v19.3,28.64 20.73,30.06 20.73,42.87 20.52,43.07 v20.52,46.73
R0_OUT  (via drill 0.33)
  Top 0.305: v19.3,25.8 IC4.7
  Bottom 0.305: v19.3,25.8 23.98,21.12 23.98,9.34 25.6,7.71 U2.11
R1  (via drill 0.33)
  Top 0.305: v7.72,31.08 5.49,28.84 5.28,28.84 4.88,28.44 IC3.5 | v11.38,51.4 12.6,52.62 v17.68,52.62 | v20.93,50.18 29.46,50.18 29.67,50.38 30.28,50.38 31.9,48.76 32.92,48.76 U1.34
  Bottom 0.305: v7.72,31.08 7.72,42.66 11.38,46.32 v11.38,51.4 | v17.68,52.62 18.69,51.6 18.69,49.98 19.3,49.37 20.93,49.37 v20.93,50.18
R1_OUT
  Top 0.305: IC3.7 4.67,25.8 3.86,25.8 2.03,23.97 2.03,10.35 17.88,10.35 U2.5
R2  (via drill 0.33)
  Top 0.305: v54.25,30.27 56.29,30.27 56.9,29.66 IC2.4 | v41.25,45.51 37.8,48.96 34.34,48.96 33.93,49.37 33.12,49.37 U1.33
  Bottom 0.305: v54.25,30.27 51.82,32.71 51.82,41.04 49.17,43.68 41.25,43.68 v41.25,45.51
R2_0UT  (via drill 0.33)
  Top 0.305: v55.68,31.69 56.49,31.69 56.9,32.1 IC2.2
  Bottom 0.305: v55.68,31.69 55.07,31.08 55.07,10.56 49.78,5.27 U4.10
R3  (via drill 0.33)
  Top 0.305: v42.67,29.66 IC7.4 | v40.44,47.34 38.2,49.57 34.54,49.57 34.14,49.98 33.12,49.98 U1.32
  Bottom 0.305: v42.67,29.66 40.44,31.89 v40.44,47.34
R3_OUT  (via drill 0.33)
  Top 0.305: v45.11,31.69 45.72,31.69 46.13,32.1 IC7.2
  Bottom 0.305: v45.11,31.69 45.92,30.88 45.92,11.37 42.27,7.71 U4.6
R4  (via drill 0.33)
  Top 0.305: v34.75,30.27 35.15,30.27 35.76,29.66 IC6.4 | v35.76,50.38 35.56,50.59 U1.31
  Bottom 0.305: v34.75,30.27 35.76,31.28 v35.76,50.38
R4_OUT  (via drill 0.33)
  Top 0.305: v36.98,31.49 36.58,31.49 35.97,32.1 IC6.2
  Bottom 0.305: v36.98,31.49 36.78,31.28 36.78,6.29 37.8,5.27 U3.10
R5  (via drill 0.33)
  Top 0.305: v23.16,29.66 25.6,29.66 IC5.4 | v23.16,50.99 31.9,50.99 32.11,51.2 32.92,51.2 U1.30
  Bottom 0.305: v23.16,50.99 v23.16,29.66
R5_OUT  (via drill 0.33)
  Top 0.305: v27.64,32.1 25.81,32.1 IC5.2
  Bottom 0.305: v27.64,32.1 28.45,31.28 28.45,28.84 28.25,28.64 28.25,26.41 31.09,23.56 31.09,21.53 31.29,21.33 31.29,8.52 30.48,7.71 U3.6
R6  (via drill 0.33)
  Top 0.305: v13.21,31.49 15.04,29.66 IC4.4 | v15.04,34.94 16.66,36.57 v21.54,36.57 | v26.82,51.81 32.92,51.81 U1.29
  Bottom 0.305: v13.21,31.49 15.04,33.32 v15.04,34.94 | v21.54,36.57 22.35,37.38 22.35,51.2 23.77,52.62 26.82,52.62 v26.82,51.81
R6_OUT  (via drill 0.33)
  Top 0.305: v18.69,31.49 15.85,31.49 15.24,32.1 IC4.2
  Bottom 0.305: v18.69,31.49 18.49,31.28 18.49,22.54 23.37,17.67 23.37,7.51 25.6,5.27 U2.10
R7
  Top 0.305: IC3.4 4.67,29.66 2.64,29.66 2.03,30.27 2.03,34.13 49.38,34.13 51.82,36.57 51.82,48.76 46.94,48.76 43.28,52.42 32.51,52.42 31.7,53.23 U1.28
R7_OUT  (via drill 0.33)
  Top 0.305: v2.85,30.47 3.05,30.47 4.67,32.1 IC3.2
  Bottom 0.305: v2.85,30.47 2.03,29.66 2.03,11.17 4.47,8.73 4.47,6.49 5.28,5.68 17.07,5.68 17.07,6.7 17.88,7.51 U2.6
REFHI
  Top 0.305: U1.20 30.28,56.48 46.53,56.48 48.56,58.51 C7.1
REFLO
  Top 0.305: C7.2 40.03,61.15 35.97,57.09 29.67,57.09 29.67,53.43 U1.18
RIN0_ADC  (via drill 0.33)
  Top 0.305: v31.5,46.73 32.92,46.73 U1.14 | v34.14,53.23 35.76,54.85 41.66,54.85 C5.1
  Bottom 0.305: v31.5,46.73 34.14,49.37 v34.14,53.23 | PR0_R.1 42.88,65.01 43.89,64 43.89,54.85 42.88,53.84 C5.1
RIN1_ADC  (via drill 0.33)
  Top 0.305: v34.54,47.34 U1.16
  Bottom 0.305: v34.54,47.34 34.95,47.74 34.95,58.11 35.56,58.72 37.59,58.72 37.59,57.7 PR1_R.2 37.8,57.5 37.8,53.84 C6.1
S0
  Top 0.305: 36.88,14.32 37.8,15.23 U3.14 | 36.88,14.32 36.78,14.21 26.62,14.21 25.6,15.23 U2.14 | 39.22,14.21 36.98,14.21 36.88,14.32 | 39.22,14.21 42.47,14.21 43.08,14.82 49.17,14.82 49.58,15.23 U4.14 | 39.22,14.21 41.86,11.57 74.78,11.57 79.25,16.04 GPIO.8
S1  (via drill 0.33)
  Top 0.305: U2.2 18.09,17.87 19.1,18.89 29.06,18.89 30.07,17.87 30.28,17.87 U3.2 30.48,17.87 31.5,18.89 38.41,18.89 38.61,18.68 41.25,18.68 U4.2 42.27,17.87 43.28,18.89 74.37,18.89 v74.78,18.48
  Bottom 0.305: v74.78,18.48 74.78,18.07 76.61,16.25 GPIO.7
SCL  (via drill 0.33)
  Top 0.305: v38.61,60.95 37.19,59.53 31.29,59.53 29.26,57.5 29.06,57.5 29.06,53.43 U1.67 | I2C1.2 79.86,5.27 61.16,5.27 60.15,6.29 47.55,6.29 45.11,8.73 14.43,8.73 13.41,7.71 JP2.5
  Bottom 0.305: v38.61,60.95 41.66,57.9 41.66,48.96 44.7,45.91 46.94,45.91 46.94,52.82 47.55,53.43 62.99,53.43 62.99,30.06 69.9,23.15 80.67,23.15 80.67,8.32 81.69,7.31 I2C1.2
SDA  (via drill 0.33)
  Top 0.305: U1.66 28.25,53.43 28.25,56.28 8.33,56.28 1.22,49.16 1.22,5.68 8.94,5.68 10.77,7.51 JP2.4 10.77,7.31 v16.66,1.41 | v67.87,6.09 78.23,6.09 79.25,7.1 I2C1.1
  Bottom 0.305: v67.87,6.09 65.84,4.05 52.02,4.05 52.02,3.44 49.99,1.41 v16.66,1.41
U1
  Top 0.305: U5.1 58.93,70.7 58.93,75.17 55.27,75.17 R1.2 55.07,75.17 51.21,75.17 R2.1
VCC
  Top 0.305: IC8.12 56.29,44.9 56.29,47.13 IC8.13
VSOUT/A0  (via drill 0.33)
  Top 0.305: U1.22 20.52,55.46 v10.36,55.46 | JP1.5 13.21,13.4 11.38,15.23 7.52,15.23 5.69,13.4 JP1.2
  Bottom 0.305: v10.36,55.46 9.55,54.65 9.55,48.35 6.3,45.1 6.3,14.01 5.69,13.4 JP1.2
VSYNC0  (via drill 0.33)
  Top 0.305: v8.13,54.85 8.33,54.65 10.57,54.65 10.77,54.85 19.91,54.85 19.91,53.43 U1.71
  Bottom 0.305: v8.13,54.85 4.27,54.85 4.27,44.49 4.67,44.08 4.67,40.43 3.66,39.41 3.66,13.81 3.25,13.4 JP1.1
YIN_0
  Top 0.305: Y0_R.2 28.45,66.03 28.45,73.55 25.81,73.55 3.1
YIN_1
  Bottom 0.305: Y1_R.2 23.77,65.83 25.6,67.66 25.6,69.08 4.1

### Text on the board
tNames: Pi Crust v5